# Altium project PCB_Project_Tomashevich.prjpcb
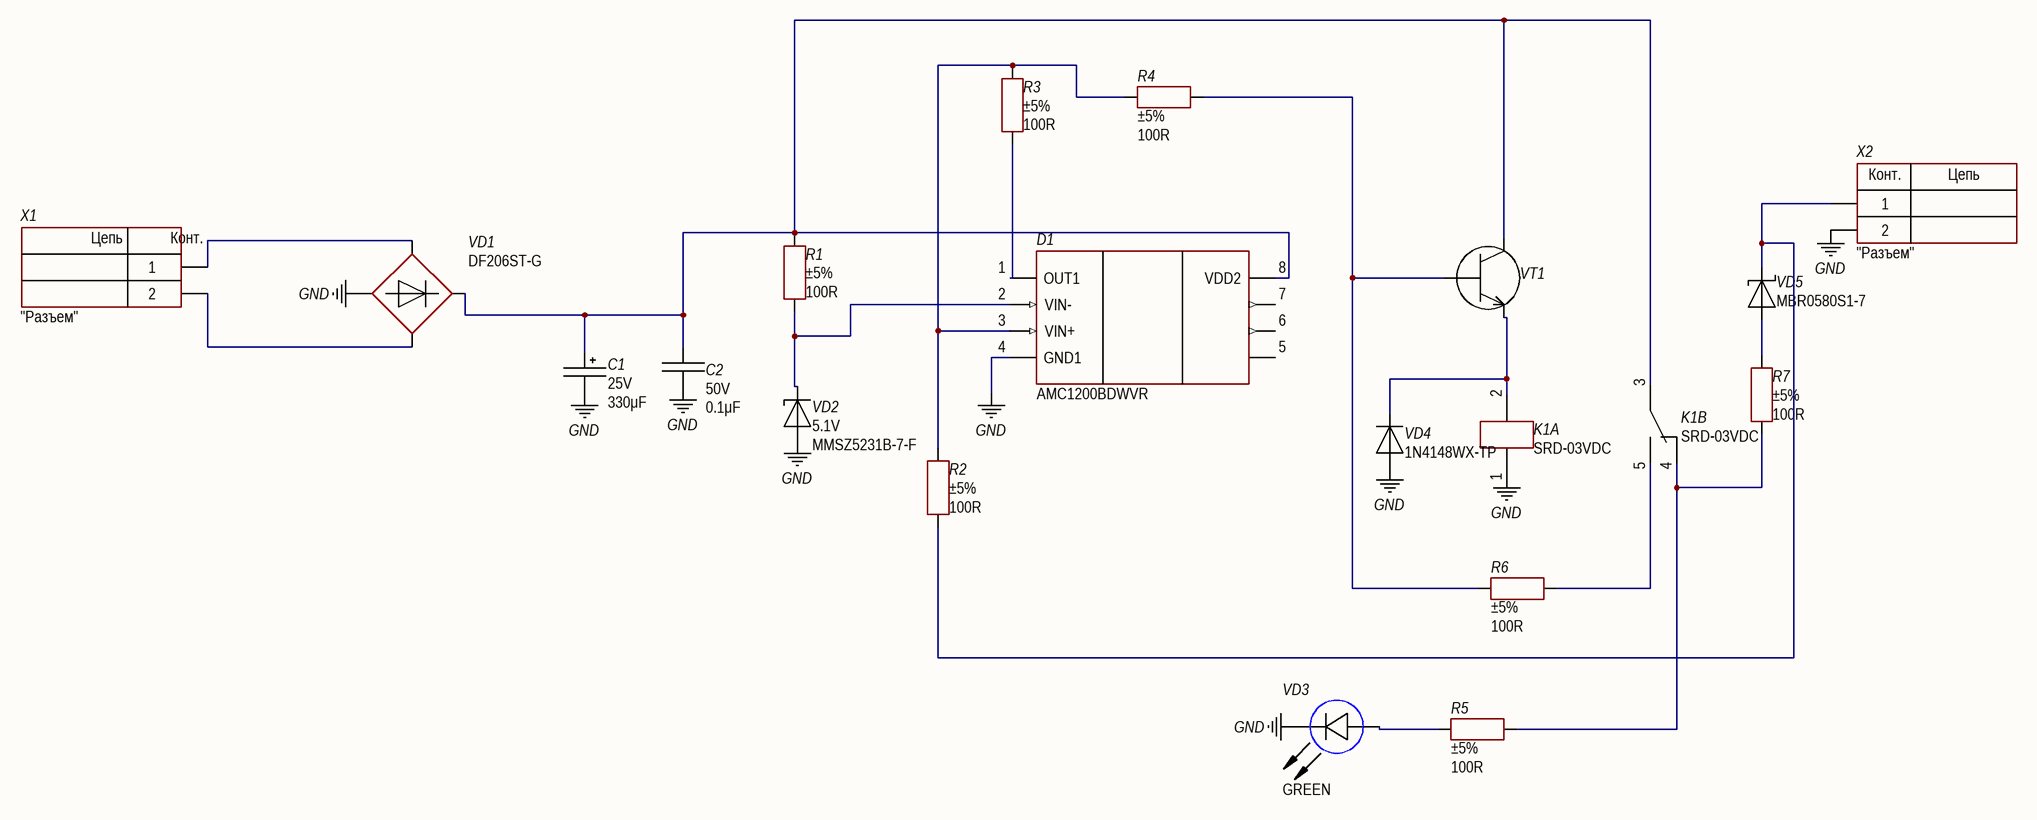
[diagram p0: Tomashevich.SchDoc]
1 sheet, 19 parts. Net scope: global (net labels, ports and power ports of the same name join across sheets).
Board file: Tomashevich.PcbDoc

## Sheet Tomashevich.SchDoc
size 420 x 297 mm; Address1: Address1; Address2: Address2; Address3: Address3; Address4: Address4; DocumentNumber: АБВГ.123456.001 Э3; SheetNumber: 1; Scale: 1:1; DocumentType: Схема электрическая принципиальная; FirstReferrence: АБВГ.123456.001

### Parts
C1  value 330μF  Voltage: 25V  [CAP: D6.3C2.5H11]
C2  value 0.1μF  Voltage: 50V  [CAP: 1206]
D1  (no value)  [8-SOIC-W]
K1  PartNumber: SRD-03VDC  [REL: SRD-03VDC]  (parts A,B of 2)
R1  value 100R  Tolerance: ±5%  [RES: 1206]
R2  value 100R  Tolerance: ±5%  [RES: 1206]
R3  value 100R  Tolerance: ±5%  [RES: 1206]
R4  value 100R  Tolerance: ±5%  [RES: 1206]
R5  value 100R  Tolerance: ±5%  [RES: 1206]
R6  value 100R  Tolerance: ±5%  [RES: 1206]
R7  value 100R  Tolerance: ±5%  [RES: 1206]
VD1  PartNumber: DF206ST-G  [DIODE: CD-MBL2]
VD2  Voltage: 5.1V  PartNumber: MMSZ5231B-7-F  [DIODE: SMA]
VD3  Color: GREEN  [LED: 1206G]
VD4  PartNumber: 1N4148WX-TP  [DIODE: SMA]
VD5  PartNumber: MBR0580S1-7  [DIODE: SMA]
VT1  transistor  [TO247]  (value not drawn)
X1  CommentText: "Разъем"  [CON: CWF-2]
X2  CommentText: "Разъем"  [CON: CWF-2]

### Nets
GND: C1.2 C2.1 D1.4(GND1) K1.1 VD1.1 VD2.1(A) VD3.2(C) VD4.1 X2.2
NetC1_1: C1.1 C2.2 D1.8(VDD2) K1.3 R1.2 VD1.3 VT1.3
NetD1_1: D1.1(OUT1) R3.1
NetD1_2: D1.2(VIN-) R1.1 VD2.2(C)
NetD1_3: D1.3(VIN+) R2.2 R3.2 R4.2
NetK1_2: K1.2 VD4.2 VT1.2
NetK1_4: K1.4 R5.1 R7.1
NetK1_5: K1.5 R6.1
NetR2_1: R2.1 VD5.2 X2.1
NetR4_1: R4.1 R6.2 VT1.1
NetR5_2: R5.2 VD3.1(A)
NetR7_2: R7.2 VD5.1
NetVD1_2: VD1.2 X1.1
NetVD1_4: VD1.4 X1.2

Not connected (* = marked no-connect by the designer): D1 5 6 7

### Notes on the sheet
- Перв. примен.
- Справ. №
- Подп. и дата
- Инв. № дубл.
- Взам. инв. №
- Разраб.
- Изм.
- Лист
- № докум.
- Подп.
- Дата
- Лит.
- Масса
- Масштаб
- Пров.
- Т.контр.
- Листов
- Инв. № подл.
- Утв.
- Н.контр.
- 2.106-A3
- Копировал
- Формат А3
- (in symbol CWF-2) Конт.; Цепь

### Library data of the parts
C1 = Aluminium: Manufacturer: Wurth; PartNumber: 860080475013; ValueManufacturerPartNumber: Aluminium capacitor, 330μF, 25V, ±20%, 54mOhm, 14x10x5 mm, -55...+105°C; TypeCapacitor: Aluminium capacitor; Tolerance: ±20%; Impedance: 54mOhm; Package: 14x10x5 mm; HelpURL: https://www.digikey.com/product-detail/en/wurth-electronics-inc/860080475013/732-9029-1-ND/5728972; Temperature: -55...+105°C
C2 = Ceramic_1206: Manufacturer: Yageo; PartNumber: CC1206KRX7R9BB104; ValueManufacturerPartNumber: Ceramic capacitor, 0.1μF, X7R, ±10%, 50V, 1206, -55...+125°C; TypeCapacitor: Ceramic capacitor; Tolerance: ±10%; TypeDielectric: X7R; Package: 1206; HelpURL: https://www.digikey.com/product-detail/en/yageo/CC1206KRX7R9BB104/311-1179-1-ND/303089; Temperature: -55...+125°C
D1 = AMC1200BDWVR: Isolator amplifier; Manufacturer: Texas Instruments; ValueManufacturerPartNumber: IC isolator amplifier, Differential, 100 kHz, 2.7...5.5V, -40...+105°C, 8-SOIC; Supply: 2.7...5.5V; OutputType: Differential; GainBandwidth: 100 kHz; HelpURL: https://www.digikey.com/product-detail/en/texas-instruments/AMC1200BDWVR/296-39898-1-ND/5177775; Package: 8-SOIC; ComponentType: IC isolator amplifier; Temperature: -40...+105°C; PartNumber: AMC1200BDWVR
K1 = Relay_SRD-03VDC: Manufacturer: Ningbo Songle; ValueManufacturerPartNumber: Electromechanics relay, 3VDC, 250VAC, 10A, 1NO, -40...+85°C; TypeRelay: Electromechanics relay; VoltageMax: 250VAC; VoltageControlCoil: 3VDC; MaxCurrent: 10A; Package: 1NO; HelpURL: https://lcsc.com/product-detail/Relays_SRD-03VDC-SL-C_C24585.html; Temperature: -40...+85°C
R1-R7 = Resistor_1206: Manufacturer: Yageo; PartNumber: RC1206JR-07100RL; ValueManufacturerPartNumber: Resistor film, 100R, ±5%, 1206, 0.25W, -55...+125°C; TypeResistor: Resistor film; Power: 0.25W; Package: 1206; HelpURL: https://www.digikey.com/product-detail/en/yageo/RC1206JR-07100RL/311-100ERCT-ND/732153; Temperature: -55...+125°C
VD1 = 1PH rectifier: Manufacturer: Comchip Technology; ValueManufacturerPartNumber: Single phase rectifier, 600V, 2A, 1.1V, 4-SMD, -55...+150°C; TypeDiode: Single phase rectifier; Voltage: 600V; Current: 2A; VoltageDrop: 1.1V; Package: 4-SMD; HelpURL: https://www.digikey.com/product-detail/en/comchip-technology/DF206ST-G/641-1425-1-ND/2208797; Temperature: -55...+150°C
VD2 = Zener_single: Manufacturer: Diodes Incorporated; ValueManufacturerPartNumber: Zener diode, 5.1V, 500mW, 0.9V, 17Ohm, SOD-123, -55...+150°C; TypeDiode: Zener diode; Current: 500mW; VoltageDrop: 0.9V; RecoveryTime: 17Ohm; Package: SOD-123; HelpURL: https://www.digikey.com/product-detail/en/diodes-incorporated/MMSZ5231B-7-F/MMSZ5231B-FDICT-ND/755506; Temperature: -55...+150°C
VD3 = LED_single: ValueManufacturerPartNumber: LED, Green, *, *, *, -55...+150°C; TypeDiode: LED; Manufacturer: *; Package: *; HelpURL: *; Temperature: -55...+150°C; Current: *; VoltageDrop: *; PartNumber: *; ColorParameter: Green
VD4 = Diode_single: Manufacturer: Micro Commercial; ValueManufacturerPartNumber: Single diode, 75V, 150mA, 1V, 4ns, SOD-323, -55...+150°C; TypeDiode: Single diode; Voltage: 75V; Current: 150mA; VoltageDrop: 1V; RecoveryTime: 4ns; Package: SOD-323; HelpURL: https://www.digikey.com/product-detail/en/micro-commercial-co/1N4148WX-TP/1N4148WXTPMSCT-ND/717312; Temperature: -55...+150°C
VD5 = Schottky_single: Manufacturer: Diodes Incorporated; ValueManufacturerPartNumber: Schottky diode, 80V, 500mA, 1V, 15pF, SOD-123, -55...+150°C; TypeDiode: Schottky diode; Voltage: 80V; Current: 500mA; VoltageDrop: 1V; RecoveryTime: 15pF; Package: SOD-123; HelpURL: https://www.digikey.com/product-detail/en/diodes-incorporated/MBR0580S1-7/MBR0580S1-7DICT-ND/5080371; Temperature: -55...+150°C
VT1 = transistor: pin to pad: 2>3 3>2
X1 X2 = CWF-2: Manufacturer: Connfly; ValueManufacturerPartNumber: Connector, 2pin, 2.54mm, 250VAC, 3A; PartNumber: CWF-2R; TypeConnector: Connector; VoltageMax: 250VAC; Pitch: 2.54mm; CurrentMax: 3A; Multichannel: 2pin; HelpURL: https://www.chipdip.ru/product/cwf-2r-ds1069-2-mr